# EAGLE schematic Up (EAGLE 9.0.0)
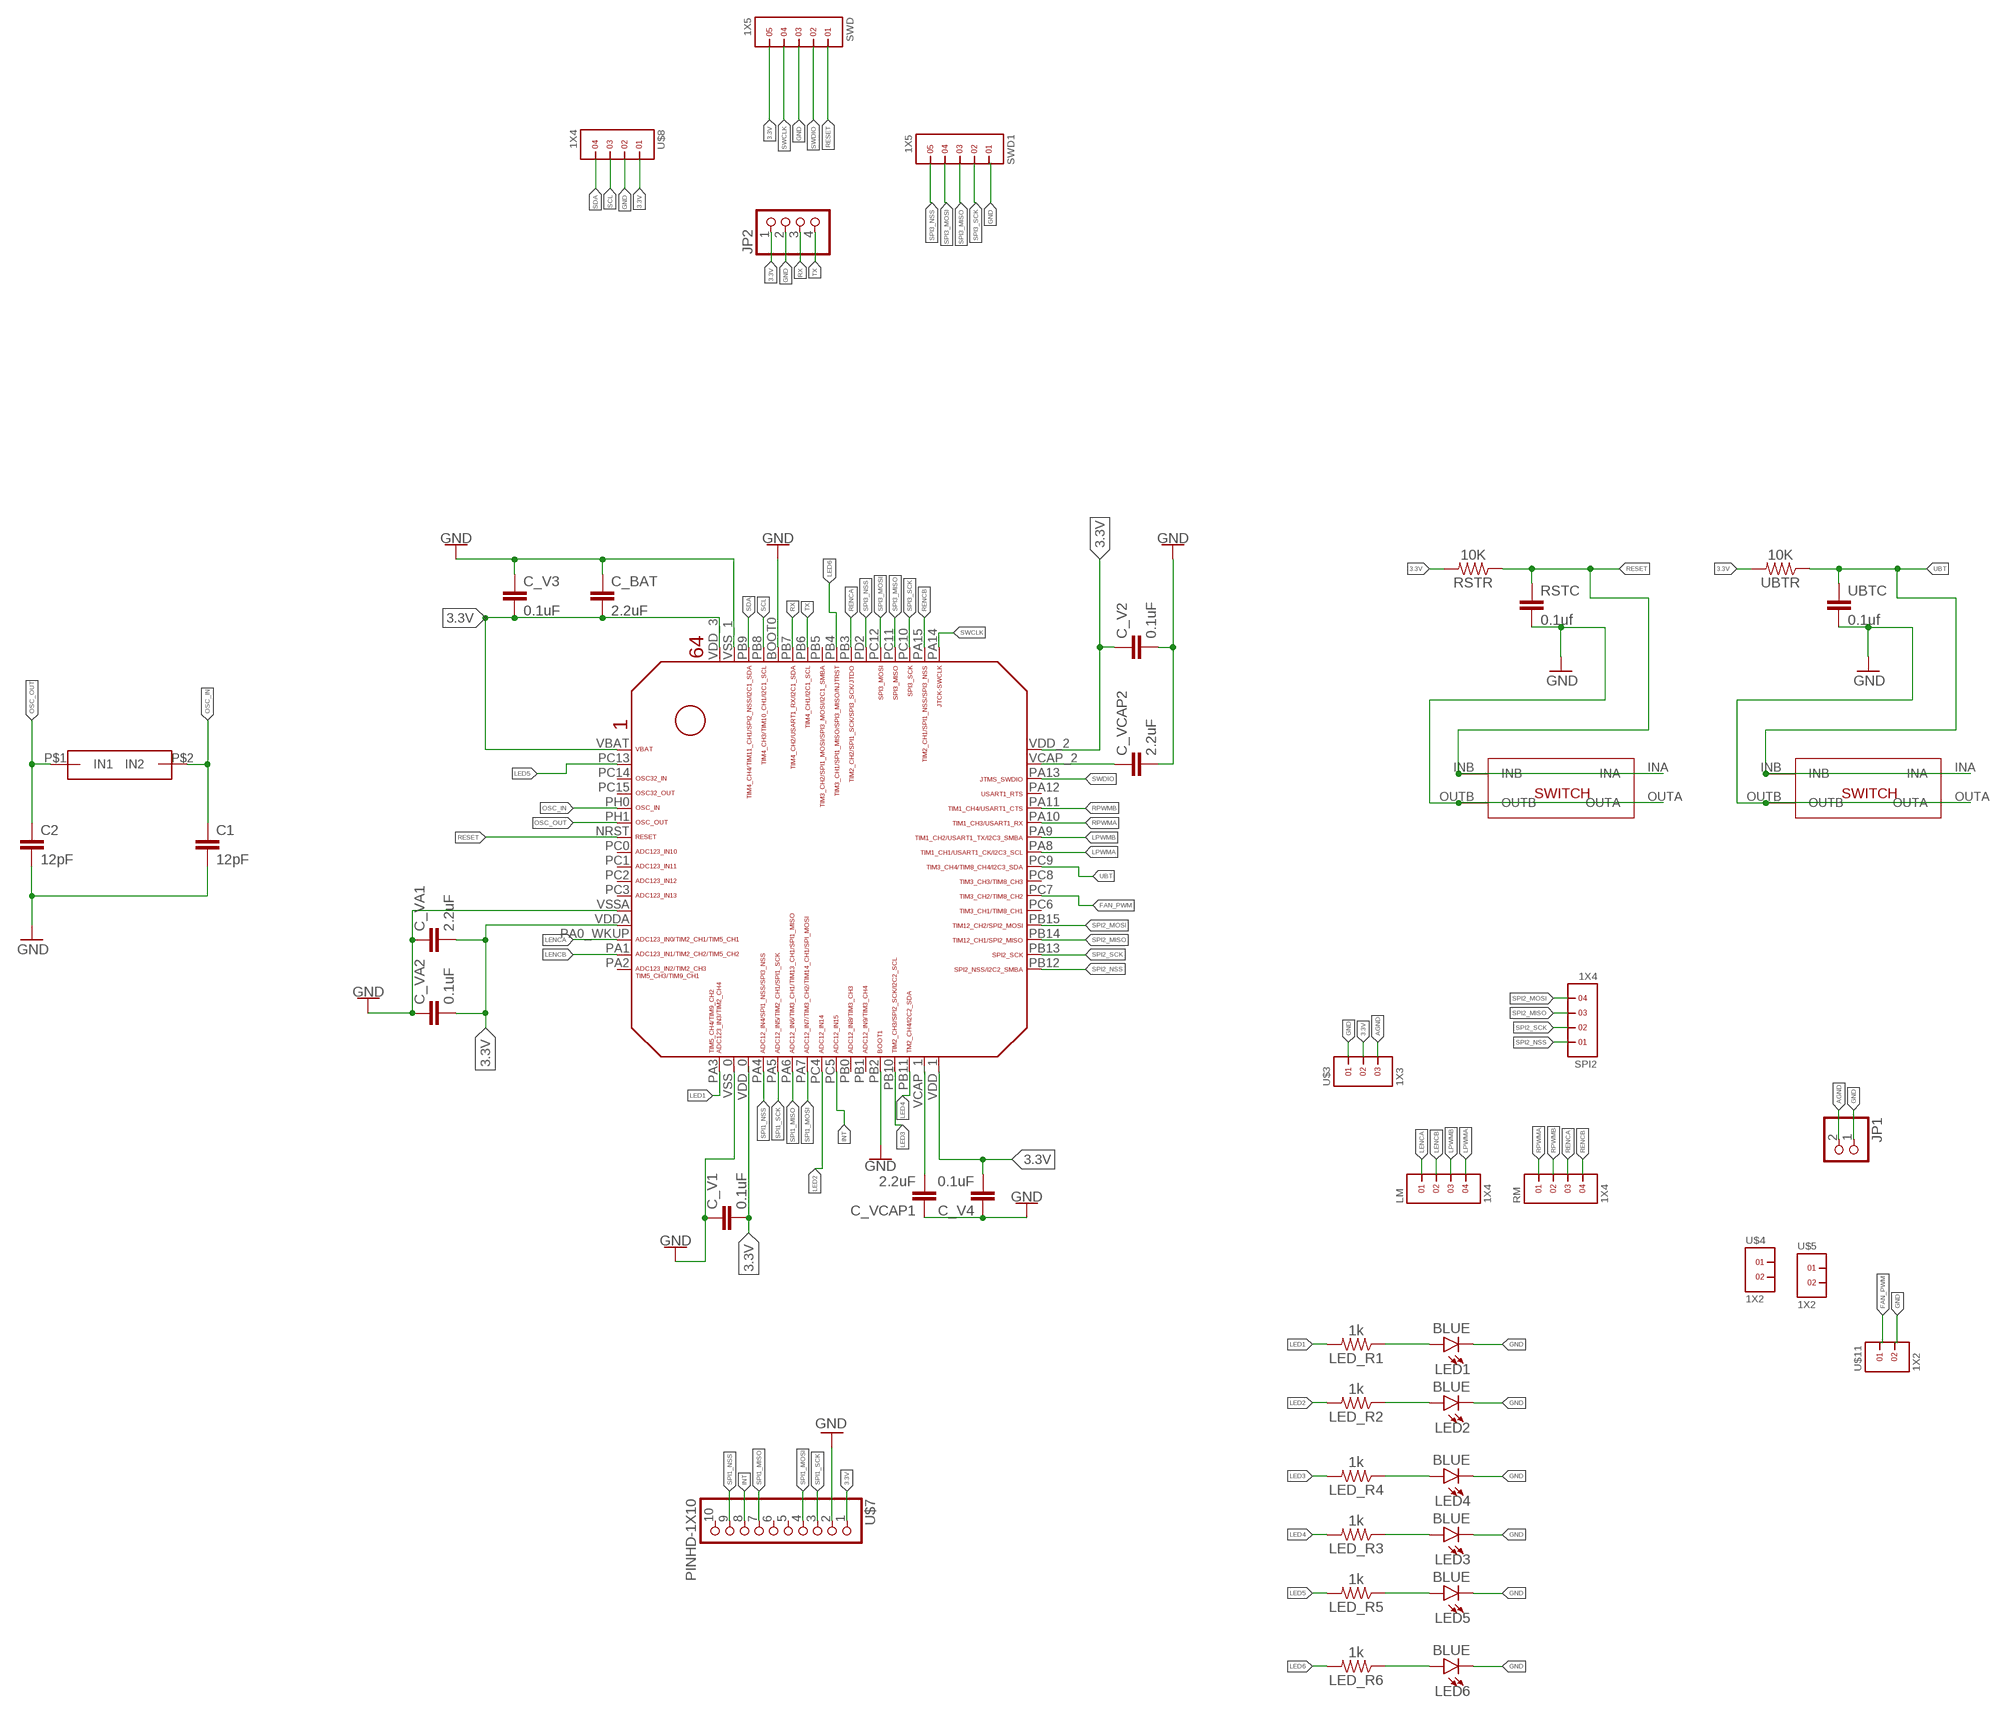
[diagram p0: schematic, sheet 1]

## Parts
C1  12pF  22PF-0603-50V-5%  [0603]
C2  12pF  22PF-0603-50V-5%  [0603]
C_BAT  2.2uF  22UF-0805-6.3V-20%  [0805]
C_V1  0.1uF  22UF-0805-6.3V-20%  [0805]
C_V2  0.1uF  22UF-0805-6.3V-20%  [0805]
C_V3  0.1uF  22UF-0805-6.3V-20%  [0805]
C_V4  0.1uF  22UF-0805-6.3V-20%  [0805]
C_VA1  2.2uF  22UF-0805-6.3V-20%  [0805]
C_VA2  0.1uF  22UF-0805-6.3V-20%  [0805]
C_VCAP1  2.2uF  22UF-0805-6.3V-20%  [0805]
C_VCAP2  2.2uF  22UF-0805-6.3V-20%  [0805]
CX5032GA*8MHZ*CYSTAL  OSC  [OSC]
JP1  PINHD-1X2  [1X02]
JP2  PINHD-1X4  [1X04]
LED1  BLUE  LED-BLUE1206  [LED-1206]
LED2  BLUE  LED-BLUE1206  [LED-1206]
LED3  BLUE  LED-BLUE1206  [LED-1206]
LED4  BLUE  LED-BLUE1206  [LED-1206]
LED5  BLUE  LED-BLUE1206  [LED-1206]
LED6  BLUE  LED-BLUE1206  [LED-1206]
LED_R1  1k  0.75OHM-0805-1/4W-1%  [0805]
LED_R2  1k  0.75OHM-0805-1/4W-1%  [0805]
LED_R3  1k  0.75OHM-0805-1/4W-1%  [0805]
LED_R4  1k  0.75OHM-0805-1/4W-1%  [0805]
LED_R5  1k  0.75OHM-0805-1/4W-1%  [0805]
LED_R6  1k  0.75OHM-0805-1/4W-1%  [0805]
LM  1X4  [1X4]
RM  1X4  [1X4]
RSTC  0.1uf  22UF-0805-6.3V-20%  [0805]
RSTR  10K  0.75OHM-0805-1/4W-1%  [0805]
SPI2  1X4  [1X4]
SWD  1X5  [1X5]
SWD1  1X5  [1X5]
U$1  STM32F405/415_LQFP64  [STM32F405/415_LQFP64]
U$3  1X3  [1X3]
U$4  1X2  [1X2]
U$5  1X2  [1X2]
U$7  PINHD-1X10  [1X10-BIG]
U$8  1X4  [1X4]
U$9  4X4X1.5_SMD_SWITCH  [4X4X1.5_SMD_SWITCH]
U$10  4X4X1.5_SMD_SWITCH  [4X4X1.5_SMD_SWITCH]
U$11  1X2  [1X2]
UBTC  0.1uf  22UF-0805-6.3V-20%  [0805]
UBTR  10K  0.75OHM-0805-1/4W-1%  [0805]

## Nets
3.3V: C_BAT.2 C_V1.2 C_V2.1 C_V3.2 C_V4.2 C_VA1.2 C_VA2.2 JP2.1 RSTR.2 SWD.5 U$1.VBAT U$1.VDD_0 U$1.VDD_1 U$1.VDD_2 U$1.VDD_3 U$1.VDDA U$3.2 U$7.1 U$8.1 UBTR.2
AGND: JP1.2 U$3.3
FAN_PWM: U$1.PC7 U$11.1
GND: C1.2 C2.2 C_BAT.1 C_V1.1 C_V2.2 C_V3.1 C_V4.1 C_VA1.1 C_VA2.1 C_VCAP1.1 C_VCAP2.2 JP1.1 JP2.2 LED1.C LED2.C LED3.C LED4.C LED5.C LED6.C RSTC.2 SWD1.1 SWD.3 U$1.BOOT0 U$1.PB2 U$1.VSS_0 U$1.VSS_1 U$1.VSSA U$3.1 U$7.2 U$8.2 U$9.OUTA U$9.OUTB U$10.OUTA U$10.OUTB U$11.2 UBTC.2
INT: U$1.PC5 U$7.8
LED1: LED_R1.2 U$1.PA3
LED2: LED_R2.2 U$1.PC4
LED3: LED_R4.2 U$1.PB10
LED4: LED_R3.2 U$1.PB11
LED5: LED_R5.2 U$1.PC13
LED6: LED_R6.2 U$1.PB4
LENCA: LM.1 U$1.PA0_WKUP(PA0_AKUP)
LENCB: LM.2 U$1.PA1
LPWMA: LM.4 U$1.PA8
LPWMB: LM.3 U$1.PA9
N$1: LED3.A LED_R3.1
N$2: LED4.A LED_R4.1
N$3: LED5.A LED_R5.1
N$4: LED6.A LED_R6.1
N$5: LED2.A LED_R2.1
N$8: LED1.A LED_R1.1
OSC_IN: C1.1 CX5032GA*8MHZ*CYSTAL.P$2(IN2) U$1.PH0
OSC_OUT: C2.1 CX5032GA*8MHZ*CYSTAL.P$1(IN1) U$1.PH1
RENCA: RM.3 U$1.PB3
RENCB: RM.4 U$1.PA15
RESET: RSTC.1 RSTR.1 SWD.1 U$1.NRST U$9.INA U$9.INB
RPWMA: RM.1 U$1.PA10
RPWMB: RM.2 U$1.PA11
RX: JP2.3 U$1.PB7
SCL: U$1.PB8 U$8.3
SDA: U$1.PB9 U$8.4
SPI1_MISO: U$1.PA6 U$7.7
SPI1_MOSI: U$1.PA7 U$7.4
SPI1_NSS: U$1.PA4 U$7.9
SPI1_SCK: U$1.PA5 U$7.3
SPI2_MISO: SPI2.3 U$1.PB14
SPI2_MOSI: SPI2.4 U$1.PB15
SPI2_NSS: SPI2.1 U$1.PB12
SPI2_SCK: SPI2.2 U$1.PB13
SPI3_MISO: SWD1.3 U$1.PC11
SPI3_MOSI: SWD1.4 U$1.PC12
SPI3_NSS: SWD1.5 U$1.PD2
SPI3_SCK: SWD1.2 U$1.PC10
SWCLK: SWD.4 U$1.PA14
SWDIO: SWD.2 U$1.PA13
TX: JP2.4 U$1.PB6
UBT: U$1.PC9 U$10.INA U$10.INB UBTC.1 UBTR.1
VCAP_1: C_VCAP1.2 U$1.VCAP_1
VCAP_2: C_VCAP2.1 U$1.VCAP_2
Unconnected: U$1.PA2 U$1.PA12 U$1.PB0 U$1.PB1 U$1.PB5 U$1.PC0 U$1.PC1 U$1.PC2 U$1.PC3 U$1.PC6 U$1.PC8 U$1.PC14 U$1.PC15 U$4.1 U$4.2 U$5.1 U$5.2 U$7.5 U$7.6 U$7.10

## Library data of the parts
C1 C2 = SparkFun-Capacitors:22PF: 22pF ceramic capacitors A capacitor is a passive two-terminal electrical component used to store electrical energy temporarily in an electric field.; PROD_ID: CAP-07876; VALUE: 22pF
C_BAT C_V1-C_V4 C_VA1 C_VA2 C_VCAP1 C_VCAP2 RSTC UBTC = SparkFun-Capacitors:22UF: 22µF ceramic capacitors A capacitor is a passive two-terminal electrical component used to store electrical energy temporarily in an electric field.; PROD_ID: CAP-08402; VALUE: 22uF
CX5032GA*8MHZ*CYSTAL = Cristal Oscillator:OSC
JP1 = pinhead:PINHD-1X2: PIN HEADER
JP2 = pinhead:PINHD-1X4: PIN HEADER
LED1-LED6 = SparkFun-LED:LED-BLUE: Blue SMD LED Used in manufacturing of various products at SparkFun Packages: 0603 - SMD 0603 package [Product Link] <http://www.digikey.com/product-detail/en/SMLE12BC7TT86/511-1589-2-ND/1641808> 1206 - SMD1206 package [Product Link] <http://www.digikey.com/product-detail/en/lite-on-inc/LTST-C150TBKT/160-1643-1-ND/573584> SparkFun Products: ESP8266 Thing-Dev Board <https://www.sparkfun.com/products/13711> RedBoard <https://www.sparkfun.com/products/12757>; PROD_ID: DIO-09911
LED_R1-LED_R6 RSTR UBTR = SparkFun-Resistors:0.75OHM: 0.75Ω resistor A resistor is a passive two-terminal electrical component that implements electrical resistance as a circuit element. Resistors act to reduce current flow, and, at the same time, act to lower voltage levels within circuits. - Wikipedia; PROD_ID: RES-08474; VALUE: 0.75
LM RM SPI2 U$8 = headers(2mm):1X4
SWD SWD1 = headers(2mm):1X5
U$1 = STM32F405RG:STM32F405/415_LQFP64
U$3 = headers(2mm):1X3
U$4 U$5 U$11 = headers(2mm):1X2
U$7 = adafruit:PINHD-1X10: Pin header 1x10 0.1" spacing With round pins
U$9 U$10 = 4X4X1.5_SMD_SWITCH:4X4X1.5_SMD_SWITCH